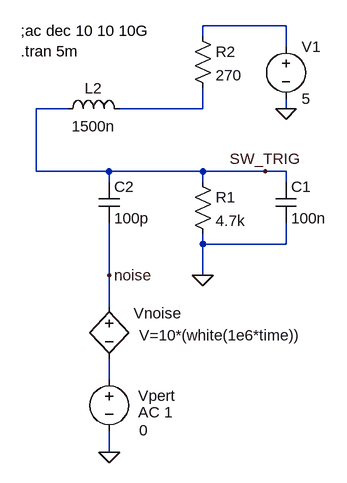
[diagram p0: schematic sw-trigger-input-pertubation.asc]
sw-trigger-input-pertubation.asc, the LTspice schematic file:
Version 4
SHEET 1 880 680
WIRE 352 -32 224 -32
WIRE 224 -16 224 -32
WIRE 352 0 352 -32
WIRE 16 96 -32 96
WIRE 224 96 224 64
WIRE 224 96 96 96
WIRE 352 96 352 80
WIRE -32 192 -32 96
WIRE 80 192 -32 192
WIRE 224 192 80 192
WIRE 320 192 224 192
WIRE 352 192 320 192
WIRE 80 208 80 192
WIRE 224 208 224 192
WIRE 352 208 352 192
WIRE 224 304 224 288
WIRE 352 304 352 272
WIRE 352 304 224 304
WIRE 80 352 80 272
WIRE 224 352 224 304
WIRE 80 400 80 352
WIRE 80 512 80 480
WIRE 80 624 80 592
FLAG 224 352 0
FLAG 352 96 0
FLAG 320 192 SW_TRIG
FLAG 80 624 0
FLAG 80 352 noise
SYMBOL cap 336 208 R0
SYMATTR InstName C1
SYMATTR Value 100n
SYMBOL res 208 192 R0
SYMATTR InstName R1
SYMATTR Value 4.7k
SYMBOL res 208 -32 R0
SYMATTR InstName R2
SYMATTR Value 270
SYMBOL ind 0 112 R270
WINDOW 0 32 56 VTop 2
WINDOW 3 5 56 VBottom 2
SYMATTR InstName L2
SYMATTR Value 1500n
SYMBOL cap 64 208 R0
SYMATTR InstName C2
SYMATTR Value 100p
SYMBOL voltage 352 -16 R0
WINDOW 123 0 0 Left 0
WINDOW 39 0 0 Left 0
SYMATTR InstName V1
SYMATTR Value 5
SYMBOL voltage 80 496 R0
WINDOW 0 45 41 Left 2
WINDOW 3 46 94 Left 2
WINDOW 123 45 67 Left 2
WINDOW 39 0 0 Left 0
SYMATTR InstName Vpert
SYMATTR Value 0
SYMATTR Value2 AC 1
SYMBOL bv 80 384 R0
WINDOW 0 38 26 Left 2
WINDOW 3 46 60 Left 2
SYMATTR InstName Vnoise
SYMATTR Value V=10*(white(1e6*time))
TEXT -56 -24 Left 2 !;ac dec 10 10 10G\n.tran 5m

The netlist it stands for:
* sw-trigger-input-pertubation.asc
C1 SW_TRIG 0 100n
R1 SW_TRIG 0 4.7k
R2 N001 N002 270
L2 SW_TRIG N002 1500n
C2 SW_TRIG noise 100p
V1 N001 0 5
Vpert N003 0 0 AC 1
B§Vnoise noise N003 V=10*(white(1e6*time))
;ac dec 10 10 10G
.tran 5m
.backanno
.end